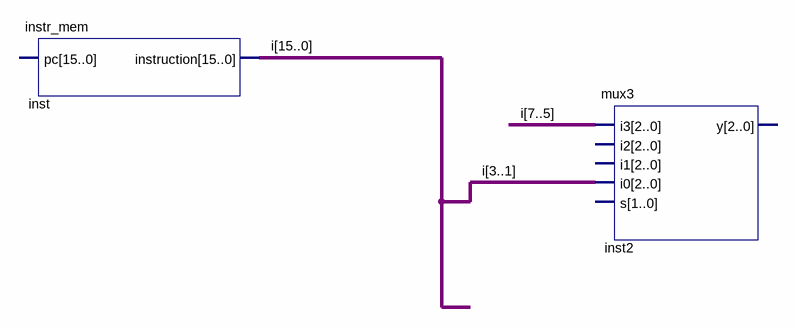
[diagram p0: schematic sheet]
// Quartus schematic test.bdf as structural Verilog: 2 symbols, 0 pins
module test (
);

  wire [15:0] i;

  instr_mem inst (.instruction(i));  // open: pc
  mux3 inst2 (.i3(i[7:5]), .i0(i[3:1]));  // open: i2, i1, s, y
endmodule
